# Altium project SC-1000527_SCH_IMUPlusIMAGIslands.PrjPcb
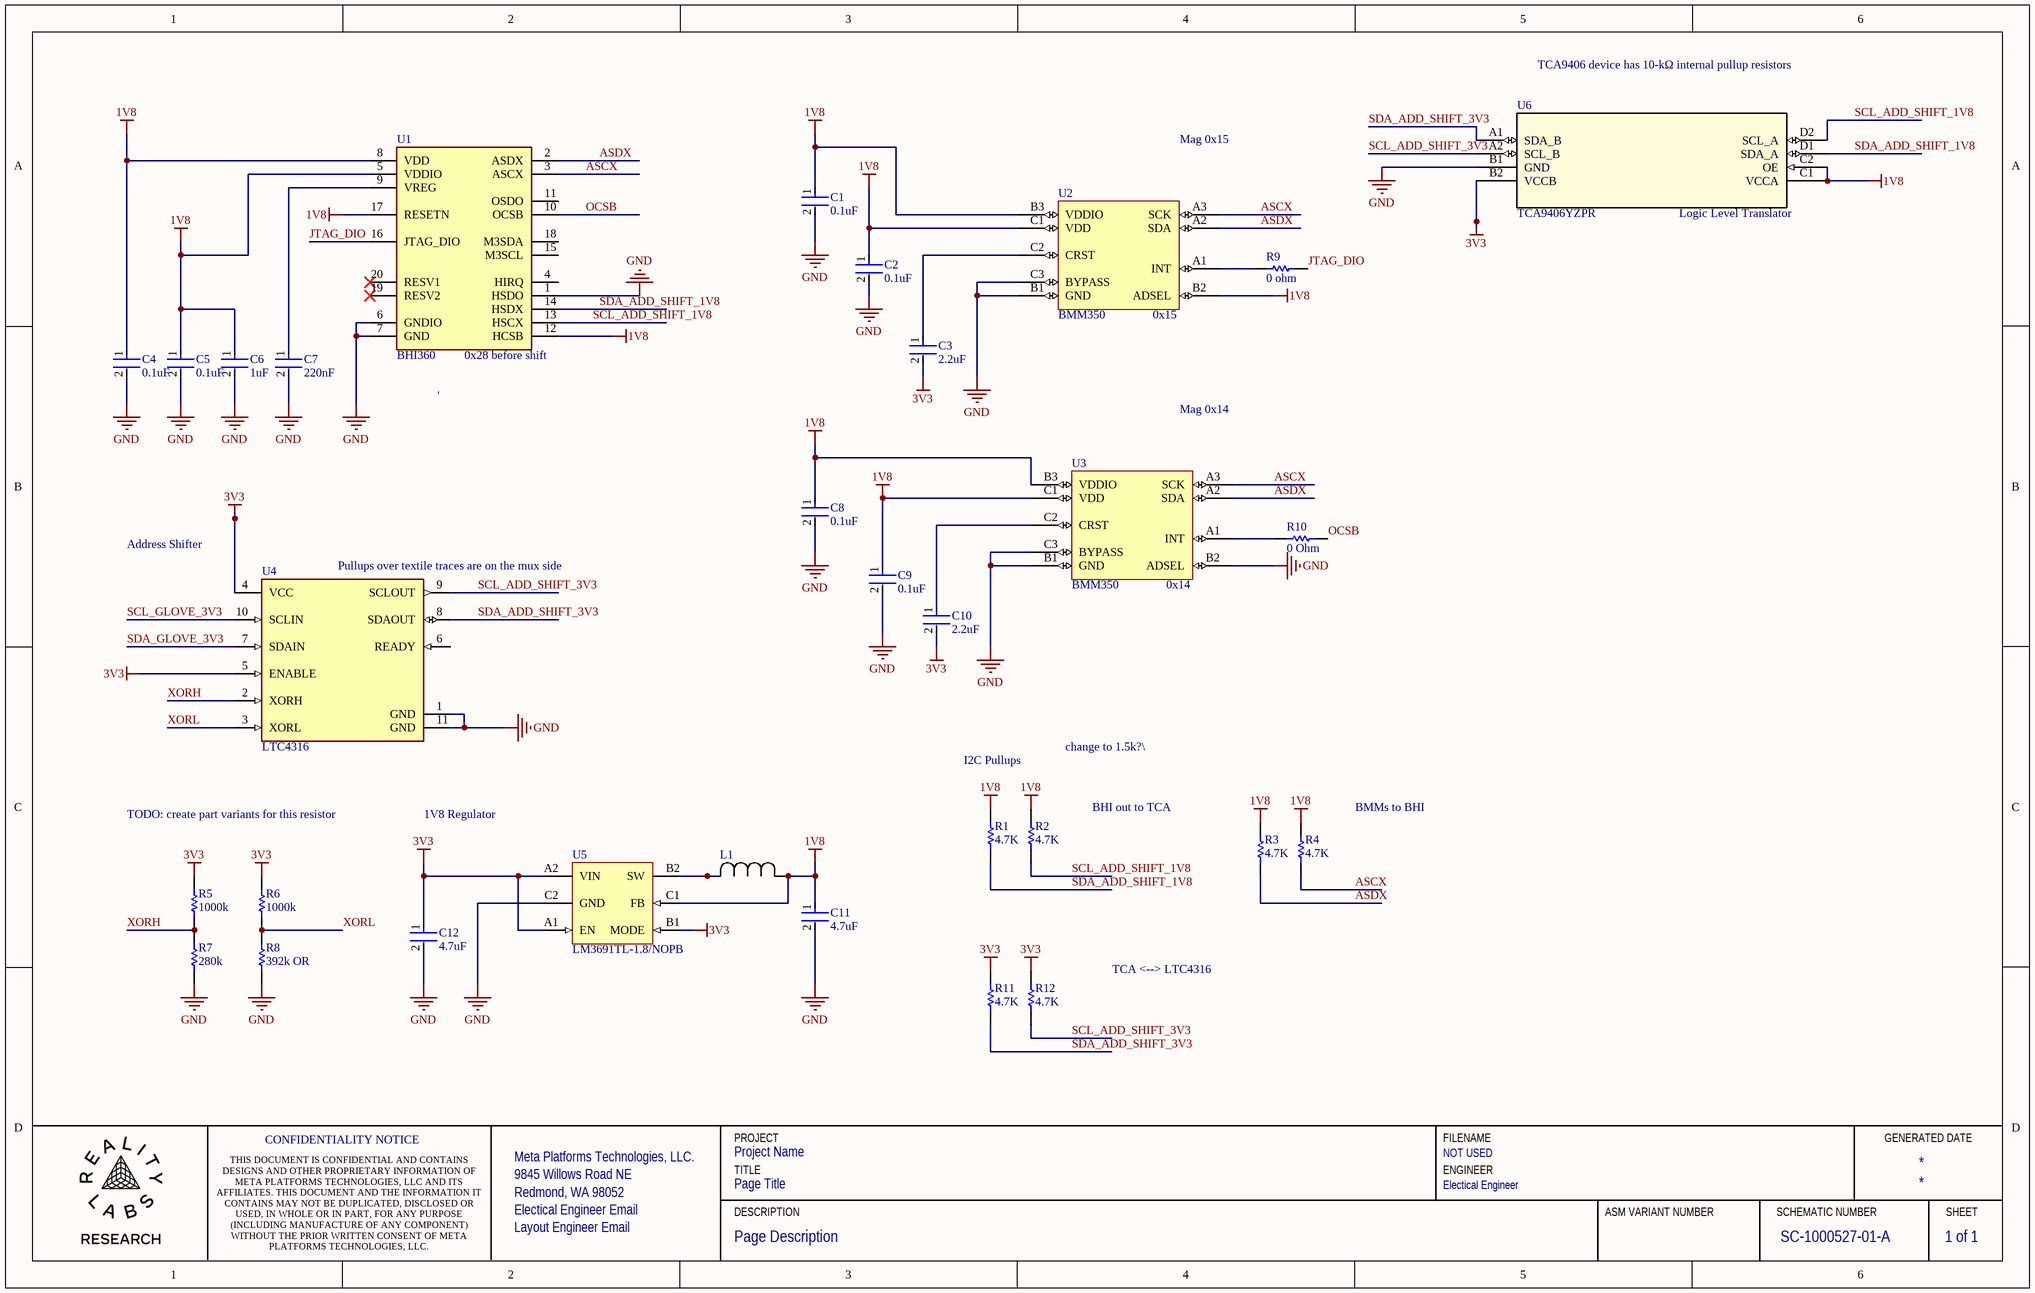
[diagram p0: SC-1000527_SCH_IMUPlusMAGIslands_Page1.SchDoc]
prjCompanyName: Meta Platforms Technologies, LLC.; prjContactAddress1: 9845 Willows Road NE; prjContactAddress2: Redmond, WA 98052; prjContactEmail: Contact Email; prjContactPhone: (...)-...-....; prjElectricalEngineer: Electical Engineer; prjElectricalEngineerEmail: Electical Engineer Email; prjFAB_IPN: EE-1002657; prjFAB_MajorRevision: 01; prjFAB_MinorRevision: A; prjFAB_Name: Board Name; prjLayoutEngineer: Layout Engineer; prjLayoutEngineerEmail: Layout Engineer Email; prjMechanicalEngineer: Mechanical Engineer; prjMechanicalEngineerEmail: Mechanical Engineer Email; prjProjectName: Project Name; prjSCH_IPN: SC-1000527; prjSCH_MajorRevision: 01; prjSCH_MinorRevision: A; XprjASM_IPN: Set v_prjASM_IPN in variant parameters; XprjASM_MajorRevision: Set v_prjASM_MajorRevision in variant parameters; XprjASM_MinorRevision: Set v_prjASM_MinorRevision in variant parameters
1 sheet, 31 parts. Net scope: global (net labels, ports and power ports of the same name join across sheets).
Board file: EE-1002657_FAB_IMUPlusMAGIslands.PcbDoc

## Sheet SC-1000527_SCH_IMUPlusMAGIslands_Page1.SchDoc: NOT USED
size B; Date: NOT USED; ApprovedBy: NOT USED; CheckedBy: NOT USED; Author: NOT USED; CompanyName: NOT USED; DrawnBy: NOT USED; Engineer: NOT USED; Organization: NOT USED; Address1: NOT USED; Address2: NOT USED; Address3: NOT USED; Address4: NOT USED; DocumentNumber: Use Project Parameter prjSchematic_IPN; Revision: NOT USED; SheetNumber: 1; SheetTotal: 1; sch_PageDescription: Page Description; sch_PageTitle: Page Title; PageDate: NOT USED; Time: NOT USED; DocumentFullPathAndName: NOT USED; DocumentName: NOT USED; ImagePath: NOT USED; ProjectName: NOT USED; Application_BuildNumber: NOT USED

### Parts
C1  0.1uF  [FP-GRM033-0_03-IPC_C]
C2  0.1uF  [FP-GRM033-0_03-IPC_C]
C3  2.2uF  [FP-GRM033-0_09-IPC_B]
C4  0.1uF  [FP-GRM033-0_03-IPC_C]
C5  0.1uF  [FP-GRM033-0_03-IPC_C]
C6  1uF  [FP-GRM033-0_05-e01_0_2-IPC_C]
C7  220nF  [FP-GRM033-0_03-MFG]
C8  0.1uF  [FP-GRM033-0_03-IPC_C]
C9  0.1uF  [FP-GRM033-0_03-IPC_C]
C10  2.2uF  [FP-GRM033-0_09-IPC_B]
C11  4.7uF  [FP-CL828-IPC_C]
C12  4.7uF  [FP-CL828-IPC_C]
L1  MCHK1608T1R0MKN  [IND_MCHK1608T1R0MKN_TAY]  (value not drawn)
R1  4.7K  [RESC0603X26X15NL03T05]
R2  4.7K  [RESC0603X26X15NL03T05]
R3  4.7K  [RESC0603X26X15NL03T05]
R4  4.7K  [RESC0603X26X15NL03T05]
R5  1000k  [RESC0603X26X15LL03T05]
R6  1000k  [RESC0603X26X15LL03T05]
R7  280k  [RESC0603X26X15LL03T05]
R8  392k OR  [RESC0603X26X15LL03T05]
R9  0 ohm  [RESC0603X28X15NL5T05]
R10  0 Ohm  [RESC0603X28X15NL5T05]
R11  4.7K  [RESC0603X26X15NL03T05]
R12  4.7K  [RESC0603X26X15NL03T05]
U1  BHI360  [BHI360]
U2  BMM350  [BMM350]
U3  BMM350  [BMM350]
U4  LTC4316  [FP-DD-10-05-08-1699-MFG]
U5  LM3691TL-1.8/NOPB  [YZR0006APAF]
U6  TCA9406YZPR  [YZP8]

### Nets
1V8: C1.1 C2.1 C4.1 C5.1 C6.1 C8.1 C9.1 C11.1 L1.1 R1.2 R2.2 R3.2 R4.2 U1.5(VDDIO) U1.8(VDD) U1.12(HCSB) U1.17(RESETN) U2.B2(ADSEL) U2.B3(VDDIO) U2.C1(VDD) U3.B3(VDDIO) U3.C1(VDD) U5.C1(FB) U6.C1(VCCA) U6.C2(OE)
3V3: C3.2 C10.2 C12.1 R5.2 R6.2 R11.2 R12.2 U4.4(VCC) U4.5(ENABLE) U5.A1(EN) U5.A2(VIN) U5.B1(MODE) U6.B2(VCCB)
GND: C1.2 C2.2 C4.2 C5.2 C6.2 C7.2 C8.2 C9.2 C11.2 C12.2 R7.1 R8.1 U1.1(HSDO) U1.6(GNDIO) U1.7(GND) U2.B1(GND) U2.C3(BYPASS) U3.B1(GND) U3.B2(ADSEL) U3.C3(BYPASS) U4.1(GND) U4.11(GND) U5.C2(GND) U6.B1(GND)
ASCX: R4.1 U1.3(ASCX) U2.A3(SCK) U3.A3(SCK)
ASDX: R3.1 U1.2(ASDX) U2.A2(SDA) U3.A2(SDA)
JTAG_DIO: R9.2 U1.16(JTAG_DIO)
OCSB: R10.2 U1.10(OCSB)
SCL_ADD_SHIFT_1V8: R2.1 U1.13(HSCX) U6.D2(SCL_A)
SCL_ADD_SHIFT_3V3: R12.1 U4.9(SCLOUT) U6.A2(SCL_B)
SCL_GLOVE_3V3: U4.10(SCLIN)
SDA_ADD_SHIFT_1V8: R1.1 U1.14(HSDX) U6.D1(SDA_A)
SDA_ADD_SHIFT_3V3: R11.1 U4.8(SDAOUT) U6.A1(SDA_B)
SDA_GLOVE_3V3: U4.7(SDAIN)
XORH: R5.1 R7.2 U4.2(XORH)
XORL: R6.1 R8.2 U4.3(XORL)
NetC3_1: C3.1 U2.C2(CRST)
NetC7_1: C7.1 U1.9(VREG)
NetC10_1: C10.1 U3.C2(CRST)
NetL1_2: L1.2 U5.B2(SW)
NetR9_1: R9.1 U2.A1(INT)
NetR10_1: R10.1 U3.A1(INT)

Not connected (* = marked no-connect by the designer): U1 4(HIRQ) 11(OSDO) 15(M3SCL) 18(M3SDA) 19(RESV2)* 20(RESV1)*; U4 6(READY)

### Notes on the sheet
- TCA9406 device has 10-kΩ internal pullup resistors
- Mag 0x15
- (near U6) Logic Level Translator
- (near U1) 0x28 before shift
- (near U2) 0x15
- '
- Mag 0x14
- Address Shifter
- (near U4) Pullups over textile traces are on the mux side
- (near U3) 0x14
- I2C Pullups
- change to 1.5k?\
- TODO: create part variants for this resistor
- 1V8 Regulator
- BHI out to TCA
- BMMs to BHI
- TCA <--> LTC4316
- CONFIDENTIALITY NOTICE
- TITLE
- PROJECT
- ENGINEER
- FILENAME
- GENERATED DATE
- DESCRIPTION
- ASM VARIANT NUMBER
- SCHEMATIC NUMBER
- SHEET
- THIS DOCUMENT IS CONFIDENTIAL AND CONTAINS DESIGNS AND OTHER PROPRIETARY INFORMATION OF META PLATFORMS TECHNOLOGIES, LLC AND ITS AFFILIATES. THIS DOCUMENT AND THE INFORMATION IT CONTAINS MAY NOT BE DUPLICATED, DISCLOSED OR USED, IN WHOLE OR IN PART, FOR ANY PURPOSE (INCLUDING MANUFACTURE OF ANY COMPONENT) WITHOUT THE PRIOR WRITTEN CONSENT OF META PLATFORMS TECHNOLOGIES, LLC.

### Library data of the parts
C1 C2 C4 C5 C8 C9 = CMP-2010-01264-2: Chip Multilayer Ceramic Capacitors for General Purpose, 0201, 0.10uF, X5R, 15%, 10%, 10V; Capacitance: 100nF; Mount: Surface Mount; Dielectric: X5R; Width: 0.012inch; Tolerance: 10%; Radiation Hardening: No; Voltage Rating: 10V; REACH SVHC: No SVHC; Height: 0.3mm; Max Operating Temperature: 85°C; Voltage Rating (DC): 10V; Thickness: 0.013inch; Termination: SMD/SMT; Lead Free: Lead Free; Package Quantity: 1; Case/Package: 0201; Min Operating Temperature: -55°C; Weight: 6E-06oz; Length: 0.6mm; Case Code (Imperial): 0201; Depth: 0.3mm; Voltage: 10V; Packaging: Tape and Reel; Case Code (Metric): 0603
C3 C10 = CMP-06035-032992-1: Chip Multilayer Ceramic Capacitors for General Purpose, 0201, 2.2uF, X5R, 15%, 10%, 10V; Min Operating Temperature: -55°C; Case/Package: 0201; Capacitance: 2.2uF; Dielectric: X5R; Case Code (Metric): 0603; Width: 0.012inch; Voltage Rating: 10V; Length: 0.024inch; Packaging: Tape and Reel; Case Code (Imperial): 0201; Mount: Surface Mount; Tolerance: 10%; Voltage Rating (DC): 10V; Max Operating Temperature: 85°C; Thickness: 0.015inch
C6 = CMP-06035-049957-1: Chip Multilayer Ceramic Capacitors for General Purpose, 0201, 1.0uF, X5R, 15%, 20%, 4V; Case Code (Metric): 0603; Height: 0.3mm; Packaging: Tape and Reel; Case/Package: 0201; Voltage Rating: 4V; Case Code (Imperial): 0201; Min Operating Temperature: -55°C; Length: 0.024inch; Package Quantity: 15000; Voltage Rating (DC): 4V; Dielectric: X5R; Thickness: 0.014inch; Termination: SMD/SMT; Tolerance: 20%; Max Operating Temperature: 85°C; Mount: Surface Mount; Width: 0.012inch; Capacitance: 1uF; Weight: 1.2E-05oz
C7 = CMP-06035-052827-1: Chip Multilayer Ceramic Capacitors for General Purpose, 0201, 0.22uF, X6S, 22%, 10%, 6.3V; Case Code (Imperial): 0201; Capacitance: 220nF; Min Operating Temperature: -55°C; Width: 0.012inch; Weight: 1.2E-05oz; Case/Package: 0201; Length: 0.024inch; Thickness: 0.013inch; Voltage Rating: 6.3V; Tolerance: 10%; Height: 0.3mm; Case Code (Metric): 0603; Dielectric: X6S; Voltage Rating (DC): 6.3V; Package Quantity: 15000; Max Operating Temperature: 105°C; Packaging: Tape and Reel; Mount: Surface Mount; Termination: SMD/SMT
C11 C12 = CMP-13271-001251-1: Cap Ceramic 4.7uF 10V X5R ±10% SMD 0402 +85°C Paper T/R; Height: 0.5mm; Mount: Surface Mount; Case Code (Metric): 1005; Case/Package: 0402; Capacitance: 4.7uF; Packaging: Tape and Reel; Dielectric: X5R; Radiation Hardening: No; Material: Ceramic; Thickness: 0.022inch; Min Operating Temperature: -55°C; Voltage Rating: 10V; Case Code (Imperial): 0402; Width: 0.02inch; Length: 1mm; Max Operating Temperature: 85°C; Lead Free: Lead Free; Tolerance: 10%; Package Quantity: 1; Depth: 0.5mm
L1 = MCHK1608T1R0MKN: No Description Available; Mfr_Name: Taiyo Yuden; Type: DEV; Copyright: Copyright (C) 2024 Ultra Librarian. All rights reserved.; Manufacturer_Part_Number: MCHK1608T1R0MKN; RefDes: RefDes
R1-R4 R11 R12 = CMP-2004-02966-1: Part Number: ERJ-1GEF4701C; Manufacturer: Panasonic
R5 R6 = CMP-2004-03447-1: Manufacturer: Panasonic; Part Number: ERJ1GNF1004C
R7 = CMP-2004-03303-1: Manufacturer: Panasonic; Part Number: ERJ-1GNF2803C
R8 = CMP-2004-02924-1: Part Number: ERJ-1GEF3923C; Manufacturer: Panasonic
R9 R10 = CMP-2004-00001-2: Chip Resistor, 0 Ohm, Jumper, 0.05 W, -55 to 155 degC, 0201 (0603 Metric), RoHS, Tape and Reel; Voltage Rating: 30 V; Case\Package: 0201; Resistance: 0 mohm; Tolerance: 5%; Power Rating: 50 mW; REACH SVHC: Unknown; Length: 0.6 mm; Packaging: Cut Tape; Weight: 6E-06 oz; ComponentLink2URL: http://www.vishay.com/docs/20052/crcw0201e3.pdf; Mounting Technology: Surface Mount; Case Code (Imperial): 0201; Radiation Hardening: No; RoHSCompliant: true; Package Quantity: 1; Min Operating Temperature: -55 degC; Height: 0.23 mm; PackageReference: 0201; ComponentLink1Description: Manufacturer URL; ComponentLink2Description: Datasheet; Case Code (Metric): 0603; DatasheetVersion: 03/2016; Width: 0.3 mm; Mount: Surface Mount; PackageDescription: 2-Pin Surface Mount Device, Body 0.6 x 0.3 mm; ComponentLink1URL: http://www.vishay.com/; Max Operating Temperature: 155 degC
U1 = BHI360: IMUs - Inertial Measurement Units Programmable smart sensor combining accelerometer, gyroscope and fusion software; Manufacturer_Name: BOSCH; Geometry.Height: 1mm; Mouser Part Number: 262-BHI360; Mouser Price/Stock: https://www.mouser.co.uk/ProductDetail/Bosch-Sensortec/BHI360?qs=ulEaXIWI0c93cz3Dqv%252BGgg%3D%3D; Manufacturer_Part_Number: BHI360; Datasheet Link: https://www.bosch-sensortec.com/media/boschsensortec/downloads/datasheets/bst-bhi360-ds000.pdf
U4 = CMP-00026-88946113-1: LTC4316IDD#TRPBF Interface - Specialized 1x I2C/SMBus Address Translator; Manufacturer Lifecycle Status: PRODUCTION; Interface: I2C; Case/Package: DFN; Mount: Surface Mount; Lifecycle Status: Production; Number of Pins: 10; RoHS: Compliant; NexarPartId: 88946113
U5 = CMP-0063-00271-3: High Accuracy, Miniature 1A, Step-Down DC-DC Converter for Portable Applications, 6-pin Micro SMD, Pb-Free; Manufacturer: Texas Instruments; PackageTopMarking: XV*I Z; CompType: MiscPower; High-Reliability: Y; PinCount: 6; PartNumber: LM3691TL-1.8/NOPB; PackageDescription: Thin Micro SMD, 6 Bump (Large), 0.5mm Pitch; RoHS: Y; PackageReference: YZR0006APAF; ComponentLink1URL: http://www.ti.com/general/docs/lit/getliterature.tsp?genericPartNumber=LM3691&fileType=pdf; Code_JEDEC: MO-211-DB; ComponentLink1Description: Datasheet URL; PowerWise: Y
U6 = TCA9406YZPR: No Description Available; Mfr_Name: Texas Instruments; Copyright: Copyright (C) 2024 Ultra Librarian. All rights reserved.; Manufacturer_Part_Number: TCA9406YZPR; RefDes: RefDes; Type: DEV

## Assembly variants
Variant_280k: not fitted R11 R12
Variant_392k: not fitted R1 R2 R11 R12
Variant_523k: not fitted R11 R12
Variant_681k: not fitted R1 R2 R11 R12